# Altium schematic sheet IR_Control.SchDoc
size A3
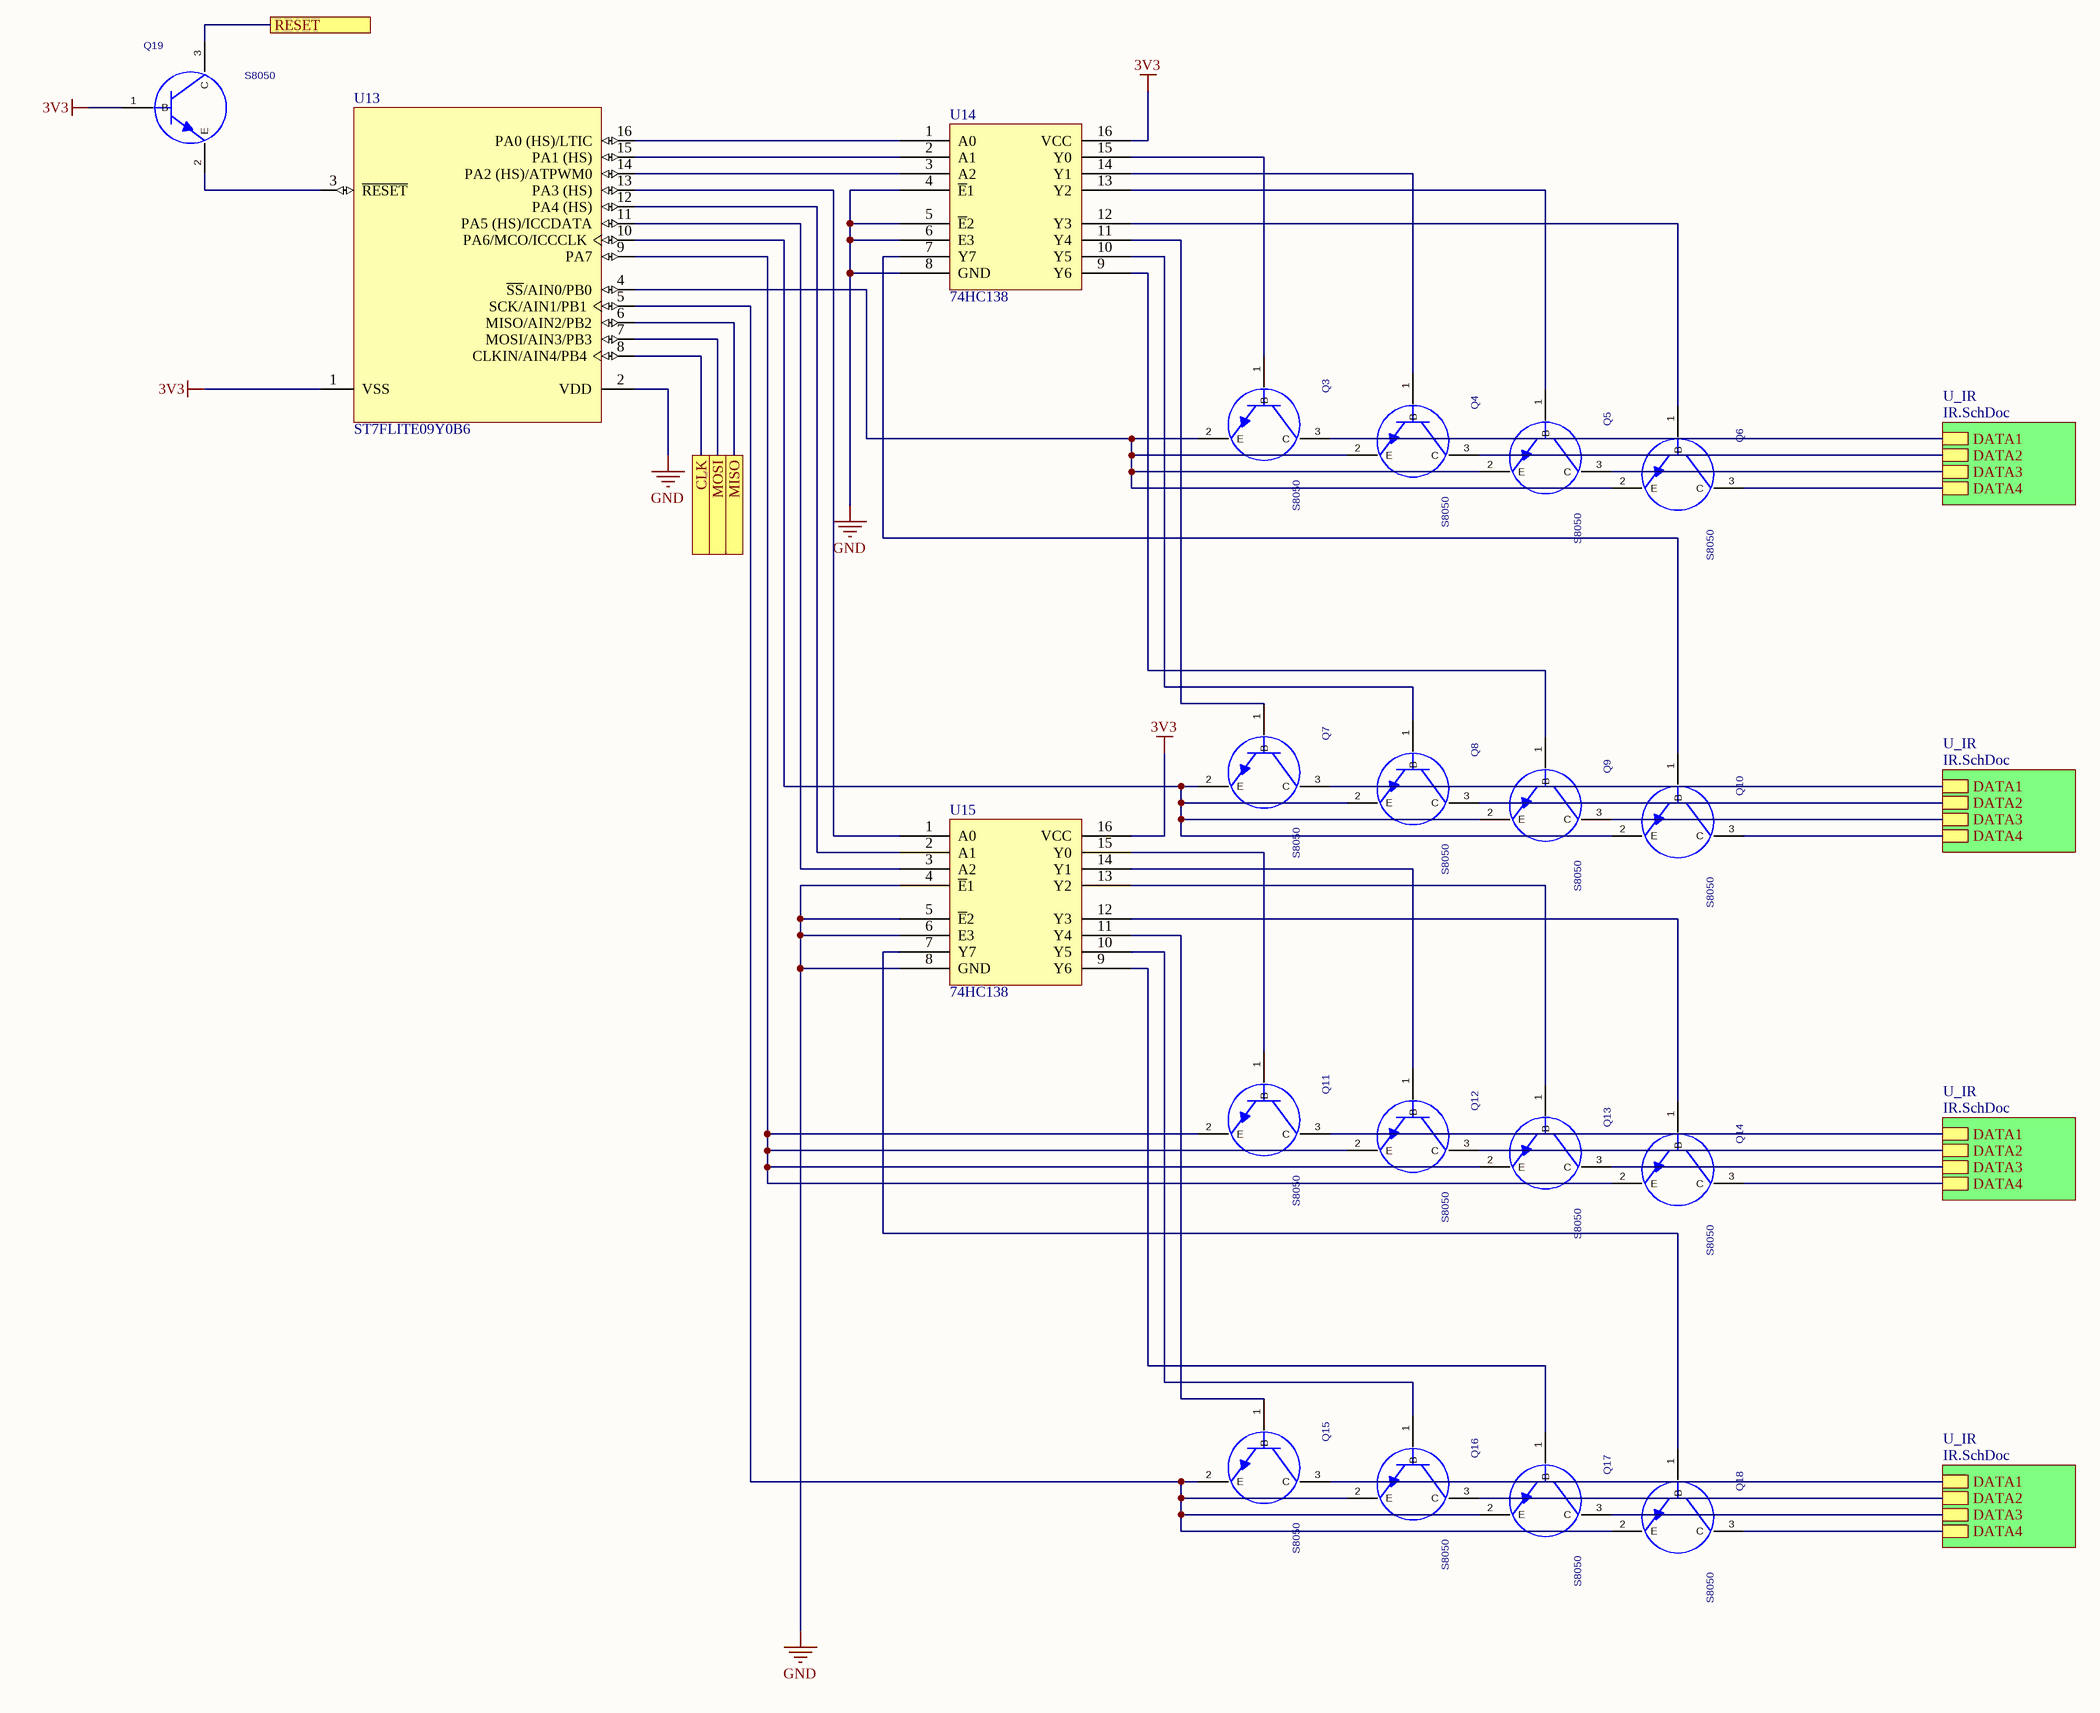
[diagram p0: IR_Control.SchDoc]

## Parts
Q3  S8050  [SOT-23]
Q4  S8050  [SOT-23]
Q5  S8050  [SOT-23]
Q6  S8050  [SOT-23]
Q7  S8050  [SOT-23]
Q8  S8050  [SOT-23]
Q9  S8050  [SOT-23]
Q10  S8050  [SOT-23]
Q11  S8050  [SOT-23]
Q12  S8050  [SOT-23]
Q13  S8050  [SOT-23]
Q14  S8050  [SOT-23]
Q15  S8050  [SOT-23]
Q16  S8050  [SOT-23]
Q17  S8050  [SOT-23]
Q18  S8050  [SOT-23]
Q19  S8050  [SOT-23]
U13  ST7FLITE09Y0B6  [PDIP16]
U14  74HC138  [74HC138]
U15  74HC138  [74HC138]

## Sub-sheets
U_IR = IR.SchDoc: DATA1, DATA2, DATA3, DATA4
U_IR = IR.SchDoc: DATA1, DATA2, DATA3, DATA4
U_IR = IR.SchDoc: DATA1, DATA2, DATA3, DATA4
U_IR = IR.SchDoc: DATA1, DATA2, DATA3, DATA4

## Ports
CLK, MISO, MOSI, RESET

## Nets
3V3: Q19.1(B) U13.1(VSS) U14.16(VCC) U15.16(VCC)
GND: U13.2(VDD) U14.4(~{E}1) U14.5(~{E}2) U14.6(E3) U14.8(GND) U15.4(~{E}1) U15.5(~{E}2) U15.6(E3) U15.8(GND)
CLK: U13.8(CLKIN/AIN4/PB4) ; port CLK
MISO: U13.6(MISO/AIN2/PB2) ; port MISO
MOSI: U13.7(MOSI/AIN3/PB3) ; port MOSI
RESET: Q19.3(C) ; port RESET
NetQ3_1: Q3.1(B) U14.15(Y0)
NetQ3_2: Q3.2(E) Q4.2(E) Q5.2(E) Q6.2(E) U13.4(~{SS}/AIN0/PB0)
NetQ3_3: Q3.3(C) ; sheet U_IR/DATA1
NetQ4_1: Q4.1(B) U14.14(Y1)
NetQ4_3: Q4.3(C) ; sheet U_IR/DATA2
NetQ5_1: Q5.1(B) U14.13(Y2)
NetQ5_3: Q5.3(C) ; sheet U_IR/DATA3
NetQ6_1: Q6.1(B) U14.12(Y3)
NetQ6_3: Q6.3(C) ; sheet U_IR/DATA4
NetQ7_1: Q7.1(B) U14.11(Y4)
NetQ7_2: Q7.2(E) Q8.2(E) Q9.2(E) Q10.2(E) U13.10(PA6/MCO/ICCCLK)
NetQ7_3: Q7.3(C) ; sheet U_IR/DATA1
NetQ8_1: Q8.1(B) U14.10(Y5)
NetQ8_3: Q8.3(C) ; sheet U_IR/DATA2
NetQ9_1: Q9.1(B) U14.9(Y6)
NetQ9_3: Q9.3(C) ; sheet U_IR/DATA3
NetQ10_1: Q10.1(B) U14.7(Y7)
NetQ10_3: Q10.3(C) ; sheet U_IR/DATA4
NetQ11_1: Q11.1(B) U15.15(Y0)
NetQ11_2: Q11.2(E) Q12.2(E) Q13.2(E) Q14.2(E) U13.9(PA7)
NetQ11_3: Q11.3(C) ; sheet U_IR/DATA1
NetQ12_1: Q12.1(B) U15.14(Y1)
NetQ12_3: Q12.3(C) ; sheet U_IR/DATA2
NetQ13_1: Q13.1(B) U15.13(Y2)
NetQ13_3: Q13.3(C) ; sheet U_IR/DATA3
NetQ14_1: Q14.1(B) U15.12(Y3)
NetQ14_3: Q14.3(C) ; sheet U_IR/DATA4
NetQ15_1: Q15.1(B) U15.11(Y4)
NetQ15_2: Q15.2(E) Q16.2(E) Q17.2(E) Q18.2(E) U13.5(SCK/AIN1/PB1)
NetQ15_3: Q15.3(C) ; sheet U_IR/DATA1
NetQ16_1: Q16.1(B) U15.10(Y5)
NetQ16_3: Q16.3(C) ; sheet U_IR/DATA2
NetQ17_1: Q17.1(B) U15.9(Y6)
NetQ17_3: Q17.3(C) ; sheet U_IR/DATA3
NetQ18_1: Q18.1(B) U15.7(Y7)
NetQ18_3: Q18.3(C) ; sheet U_IR/DATA4
NetQ19_2: Q19.2(E) U13.3(~{RESET})
NetU13_11: U13.11(PA5_(HS)/ICCDATA) U15.3(A2)
NetU13_12: U13.12(PA4_(HS)) U15.2(A1)
NetU13_13: U13.13(PA3_(HS)) U15.1(A0)
NetU13_14: U13.14(PA2_(HS)/ATPWM0) U14.3(A2)
NetU13_15: U13.15(PA1_(HS)) U14.2(A1)
NetU13_16: U13.16(PA0_(HS)/LTIC) U14.1(A0)

## Library data of the parts
Q3-Q19 = S8050: NPN; Manufacturer #2: 8050; PCB DECAL: SOT-23
U13 = ST7FLITE09Y0B6: 8-Bit MCU with 1.5k Single Voltage FLASH Memory, 128b RAM, Data EEPROM, 8-Bit ADC with Op-Amp, Timers and SPI, 16-Pin DIP; Note: Pins 4, 7, 9 and 16 are External Interrupt (EI) pins.; Published: 26-May-2004; LatestRevisionDate: 06-Jun-2005; LatestRevisionNote: Stylized 3D Model Added.; DatasheetVersion: rev2.5, Dec-2003; PackageVersion: Dec-2003; PackageReference: PDIP16; Publisher: Altium Limited; PackageDescription: DIP; 16 Leads; Row Spacing 7.62 mm; Pitch 2.54 mm; ComponentLink1Description: Manufacturer Link; ComponentLink1URL: http://www.st.com/; ComponentLink2Description: Datasheet; ComponentLink2URL: http://www.st.com/stonline/products/literature/ds/8348/st7lite0.pdf